# Altium schematic sheet XMOS_TSBOARD_Clock.SchDoc
size A4; DocumentNumber: 4; SheetNumber: 4; SheetTotal: 8
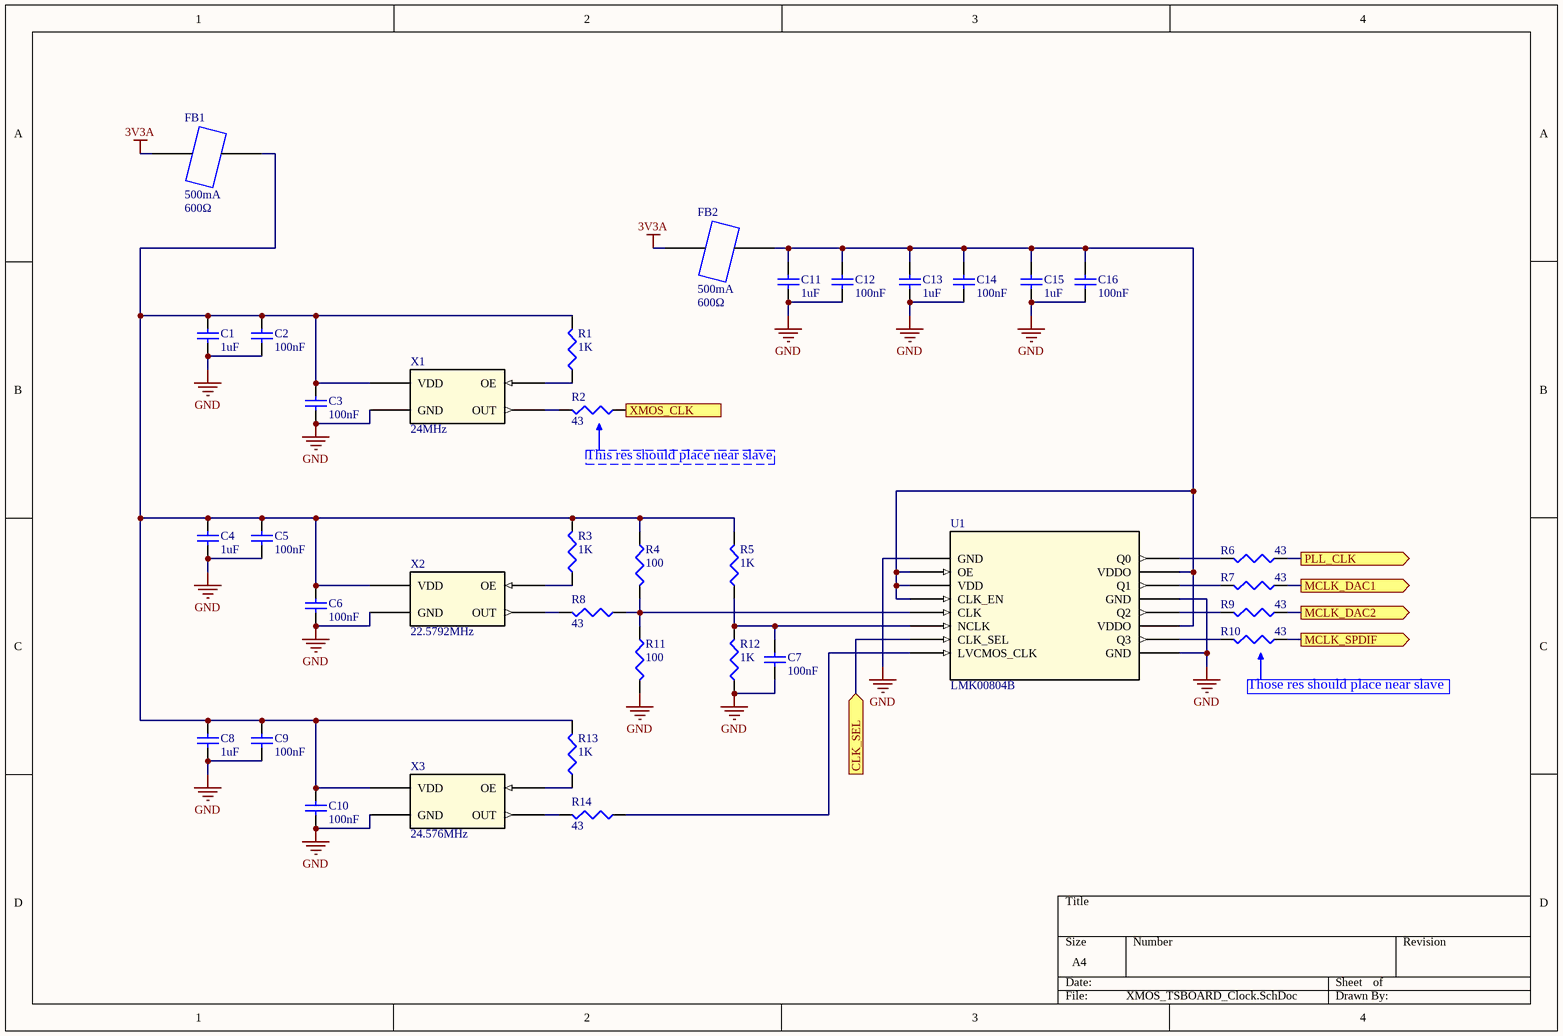
[diagram p0: XMOS_TSBOARD_Clock.SchDoc]

## Parts
C1  value 1uF  [1608[0603]]  (hidden comment: Cap Semi)
C2  value 100nF  [1608[0603]]  (hidden comment: Cap Semi)
C3  value 100nF  [1608[0603]]  (hidden comment: Cap Semi)
C4  value 1uF  [1608[0603]]  (hidden comment: Cap Semi)
C5  value 100nF  [1608[0603]]  (hidden comment: Cap Semi)
C6  value 100nF  [1608[0603]]  (hidden comment: Cap Semi)
C7  value 100nF  [1608[0603]]  (hidden comment: Cap Semi)
C8  value 1uF  [1608[0603]]  (hidden comment: Cap Semi)
C9  value 100nF  [1608[0603]]  (hidden comment: Cap Semi)
C10  value 100nF  [1608[0603]]  (hidden comment: Cap Semi)
C11  value 1uF  [1608[0603]]  (hidden comment: Cap Semi)
C12  value 100nF  [1608[0603]]  (hidden comment: Cap Semi)
C13  value 1uF  [1608[0603]]  (hidden comment: Cap Semi)
C14  value 100nF  [1608[0603]]  (hidden comment: Cap Semi)
C15  value 1uF  [1608[0603]]  (hidden comment: Cap Semi)
C16  value 100nF  [1608[0603]]  (hidden comment: Cap Semi)
FB1  RatedCurrent: 500mA  Impedance(100MHz): 600Ω  [0603]  (hidden comment: FerriteBeads)
FB2  RatedCurrent: 500mA  Impedance(100MHz): 600Ω  [0603]  (hidden comment: FerriteBeads)
R1  value 1K  [J1-0603]  (hidden comment: Res3)
R2  value 43  [J1-0603]  (hidden comment: Res3)
R3  value 1K  [J1-0603]  (hidden comment: Res3)
R4  value 100  [J1-0603]  (hidden comment: Res3)
R5  value 1K  [J1-0603]  (hidden comment: Res3)
R6  value 43  [J1-0603]  (hidden comment: Res3)
R7  value 43  [J1-0603]  (hidden comment: Res3)
R8  value 43  [J1-0603]  (hidden comment: Res3)
R9  value 43  [J1-0603]  (hidden comment: Res3)
R10  value 43  [J1-0603]  (hidden comment: Res3)
R11  value 100  [J1-0603]  (hidden comment: Res3)
R12  value 1K  [J1-0603]  (hidden comment: Res3)
R13  value 1K  [J1-0603]  (hidden comment: Res3)
R14  value 43  [J1-0603]  (hidden comment: Res3)
U1  LMK00804B  [PW16]
X1  Frequency: 24MHz  [7050]  (hidden comment: SiT8208)
X2  Frequency: 22.5792MHz  [7050]  (hidden comment: SiT8208)
X3  Frequency: 24.576MHz  [7050]  (hidden comment: SiT8208)

## Ports
CLK_SEL (in), MCLK_DAC1 (out), MCLK_DAC2 (out), MCLK_SPDIF (out), PLL_CLK (out), XMOS_CLK (out)

## Nets
3V3A: FB1.1 FB2.1
GND: C1.1 C2.1 C3.1 C4.1 C5.1 C6.1 C7.1 C8.1 C9.1 C10.1 C11.1 C12.1 C13.1 C14.1 C15.1 C16.1 R11.2 R12.1 U1.1(GND) U1.9(GND) U1.13(GND) X1.2(GND) X2.2(GND) X3.2(GND)
CLK_SEL: U1.7(CLK_SEL) ; port CLK_SEL
MCLK_DAC1: R7.1 ; port MCLK_DAC1
MCLK_DAC2: R9.1 ; port MCLK_DAC2
MCLK_SPDIF: R10.1 ; port MCLK_SPDIF
PLL_CLK: R6.1 ; port PLL_CLK
XMOS_CLK: R2.1 ; port XMOS_CLK
NetC1_2: C1.2 C2.2 C3.2 C4.2 C5.2 C6.2 C8.2 C9.2 C10.2 FB1.2 R1.2 R3.2 R4.1 R5.2 R13.2 X1.4(VDD) X2.4(VDD) X3.4(VDD)
NetC7_2: C7.2 R5.1 R12.2 U1.6(NCLK)
NetC11_2: C11.2 C12.2 C13.2 C14.2 C15.2 C16.2 FB2.2 U1.2(OE) U1.3(VDD) U1.4(CLK_EN) U1.11(VDDO) U1.15(VDDO)
NetR1_1: R1.1 X1.1(OE)
NetR2_2: R2.2 X1.3(OUT)
NetR3_1: R3.1 X2.1(OE)
NetR4_2: R4.2 R8.1 R11.1 U1.5(CLK)
NetR6_2: R6.2 U1.16(Q0)
NetR7_2: R7.2 U1.14(Q1)
NetR8_2: R8.2 X2.3(OUT)
NetR9_2: R9.2 U1.12(Q2)
NetR10_2: R10.2 U1.10(Q3)
NetR13_1: R13.1 X3.1(OE)
NetR14_1: R14.1 U1.8(LVCMOS_CLK)
NetR14_2: R14.2 X3.3(OUT)

## Notes on the sheet
- (near R2) This res should place near slave
- (near R10) Those res should place near slave

## Library data of the parts
C1-C16 = Cap Semi: Capacitor (Semiconductor SIM Model); Published: 8-Jun-2000; LatestRevisionDate: 29-May-2009; LatestRevisionNote: IPC-7351 Footprint Added.; PackageReference: C1206; Publisher: Altium Limited; PackageDescription: Chip Capacitor
FB1 FB2 = FerriteBeads: Chip Ferrite Beads; DCResistance: 0.35Ω; ManID: BLM18EG601
R1-R14 = Res3: Resistor; Published: 8-Jun-2000; LatestRevisionDate: 29-May-2009; LatestRevisionNote: IPC-7351 Footprint Added.; PackageReference: J1-0603; Publisher: Altium Limited; PackageDescription: Chip Resistor
U1 = LMK00804B: Low Skew, 1-to-4 Multiplexed Differential/LVCMOS-to-LVCMOS/TTL Fanout Buffer
X1-X3 = SiT8208: Ultra Performance Oscillator